# EasyEDA Pro project Exam.epro

# Schematic Schematic1

## Sheets
1 P1: Board Name: Board1; Create Date: 2025-04-11; Page Name: P1; Project Name: TUSB4020BPHP; Schematic Name: Schematic1; Update Date: 2025-04-18; Company: 嘉立创EDA; Page Size: A3; Version: V1.0
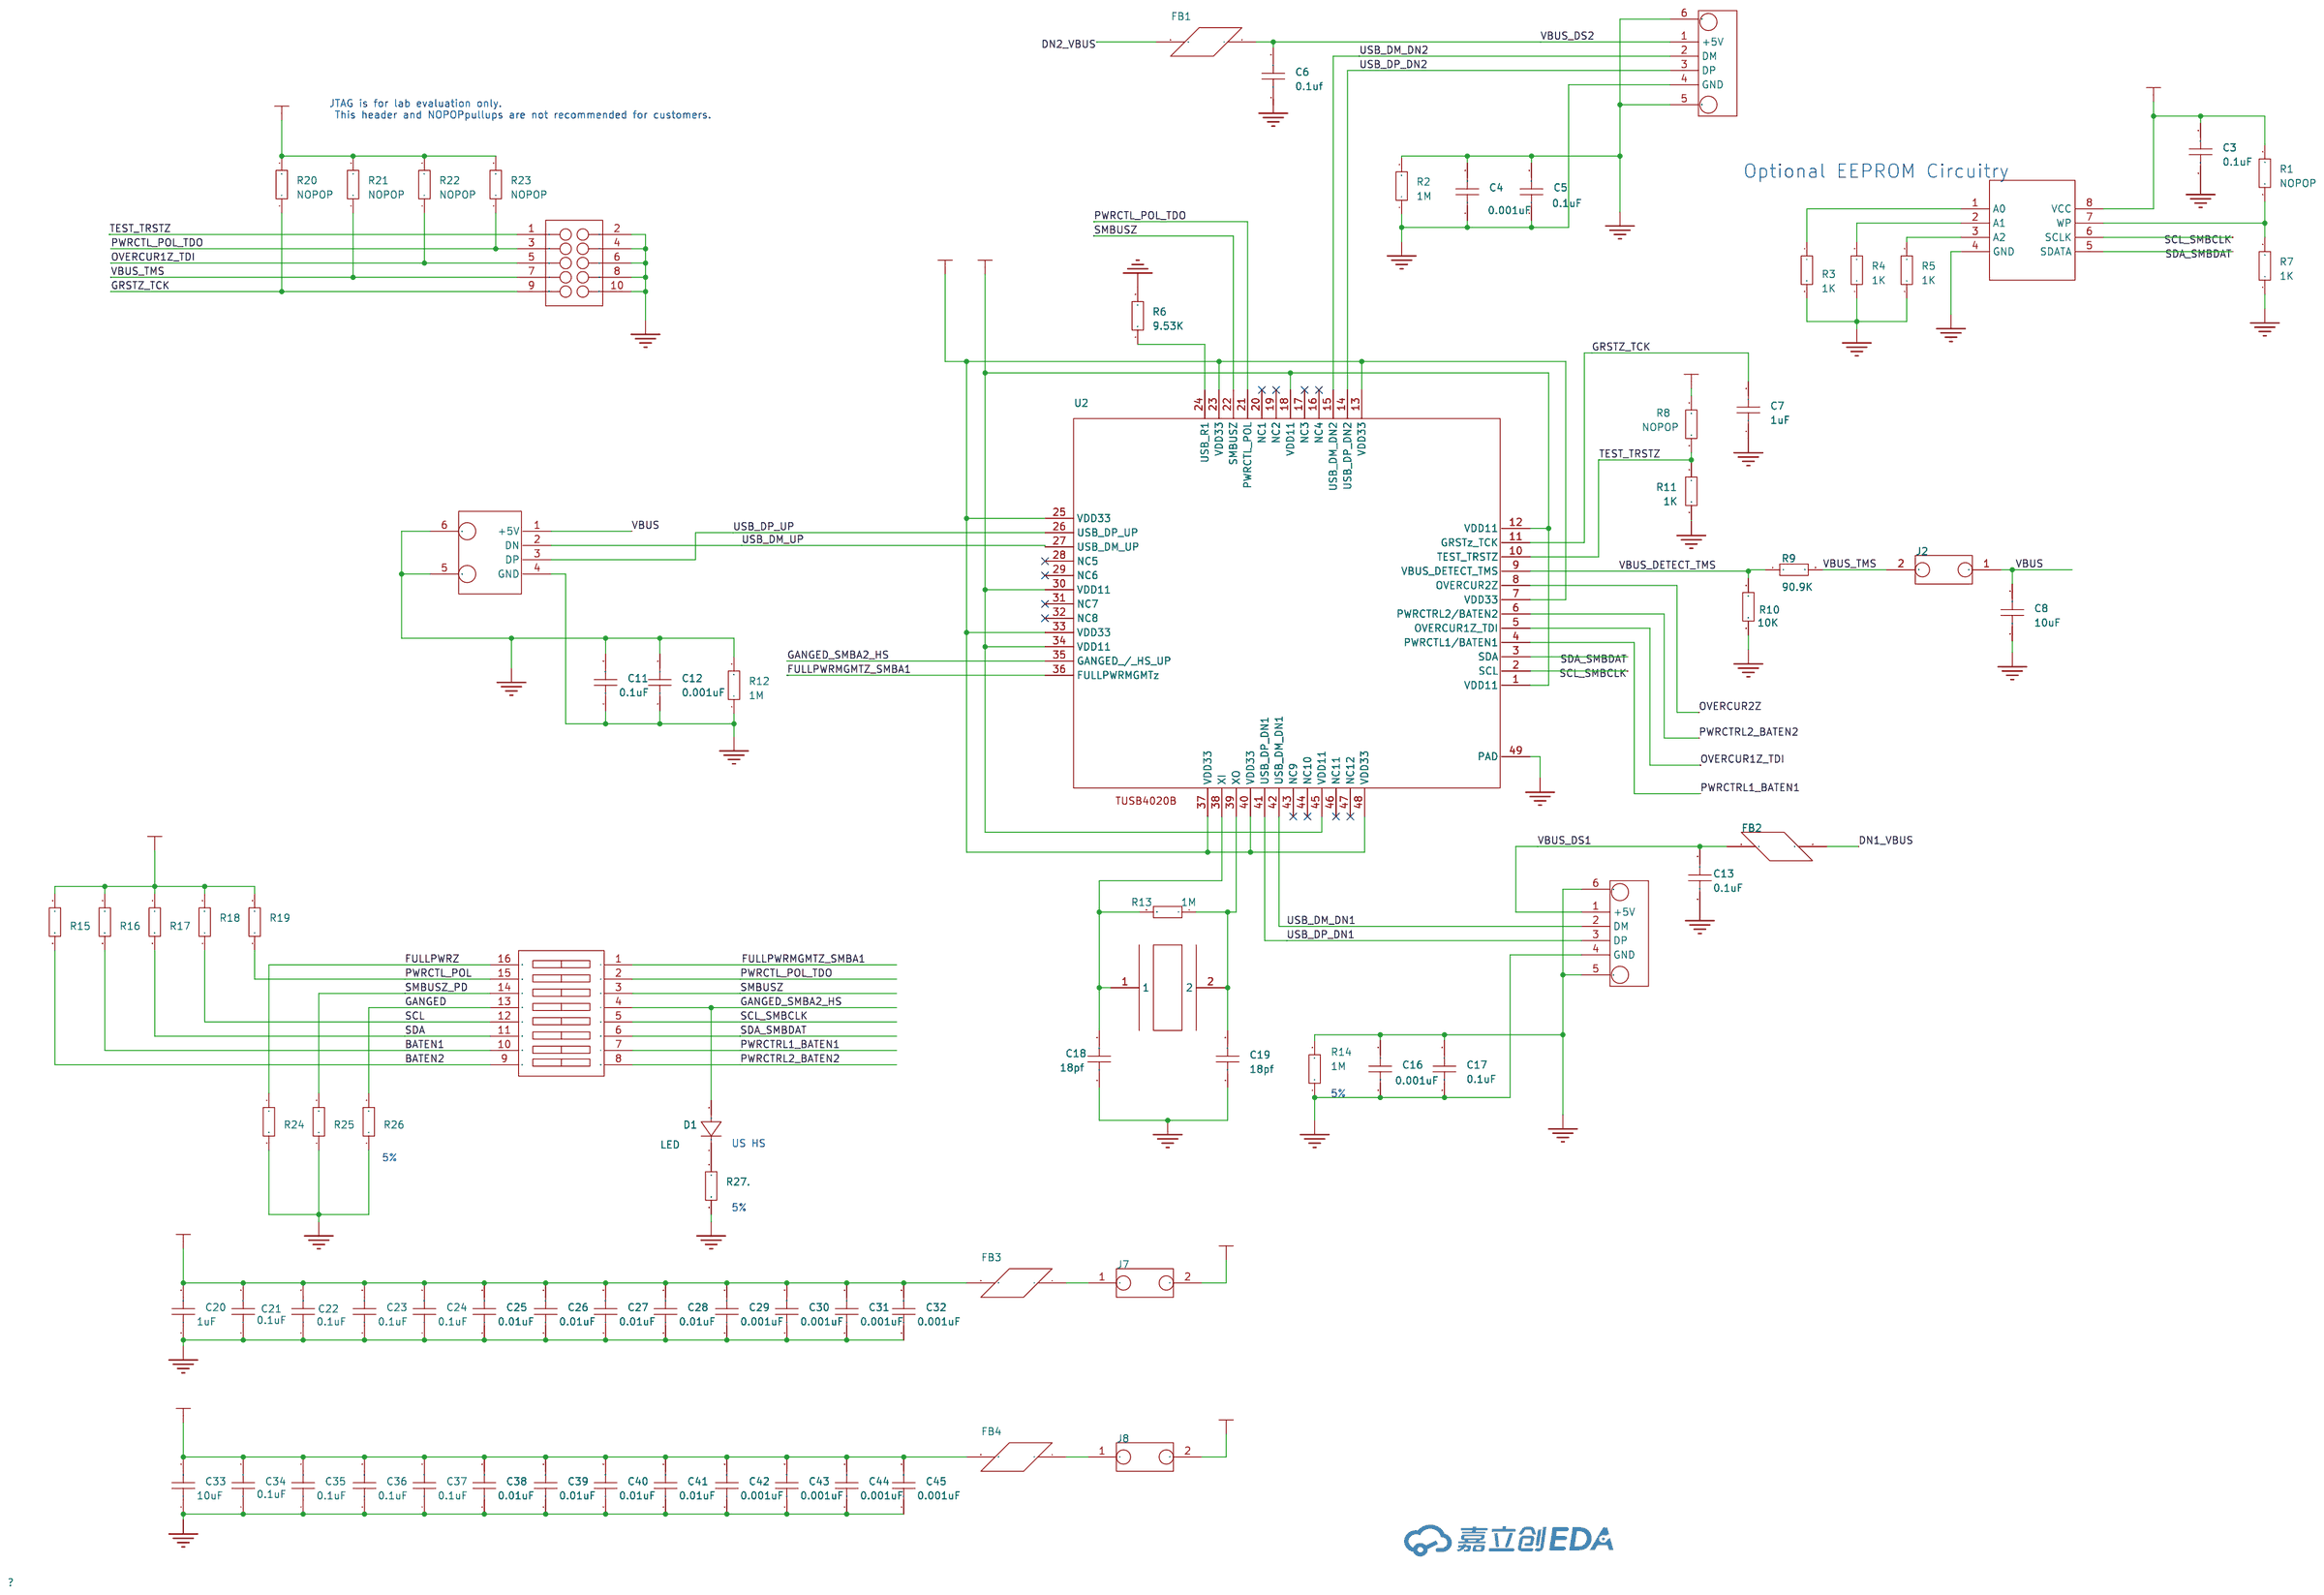
[diagram p0: P1]
2 P2: Create Date: 2025-04-13; Page Name: P2; Page Size: A4
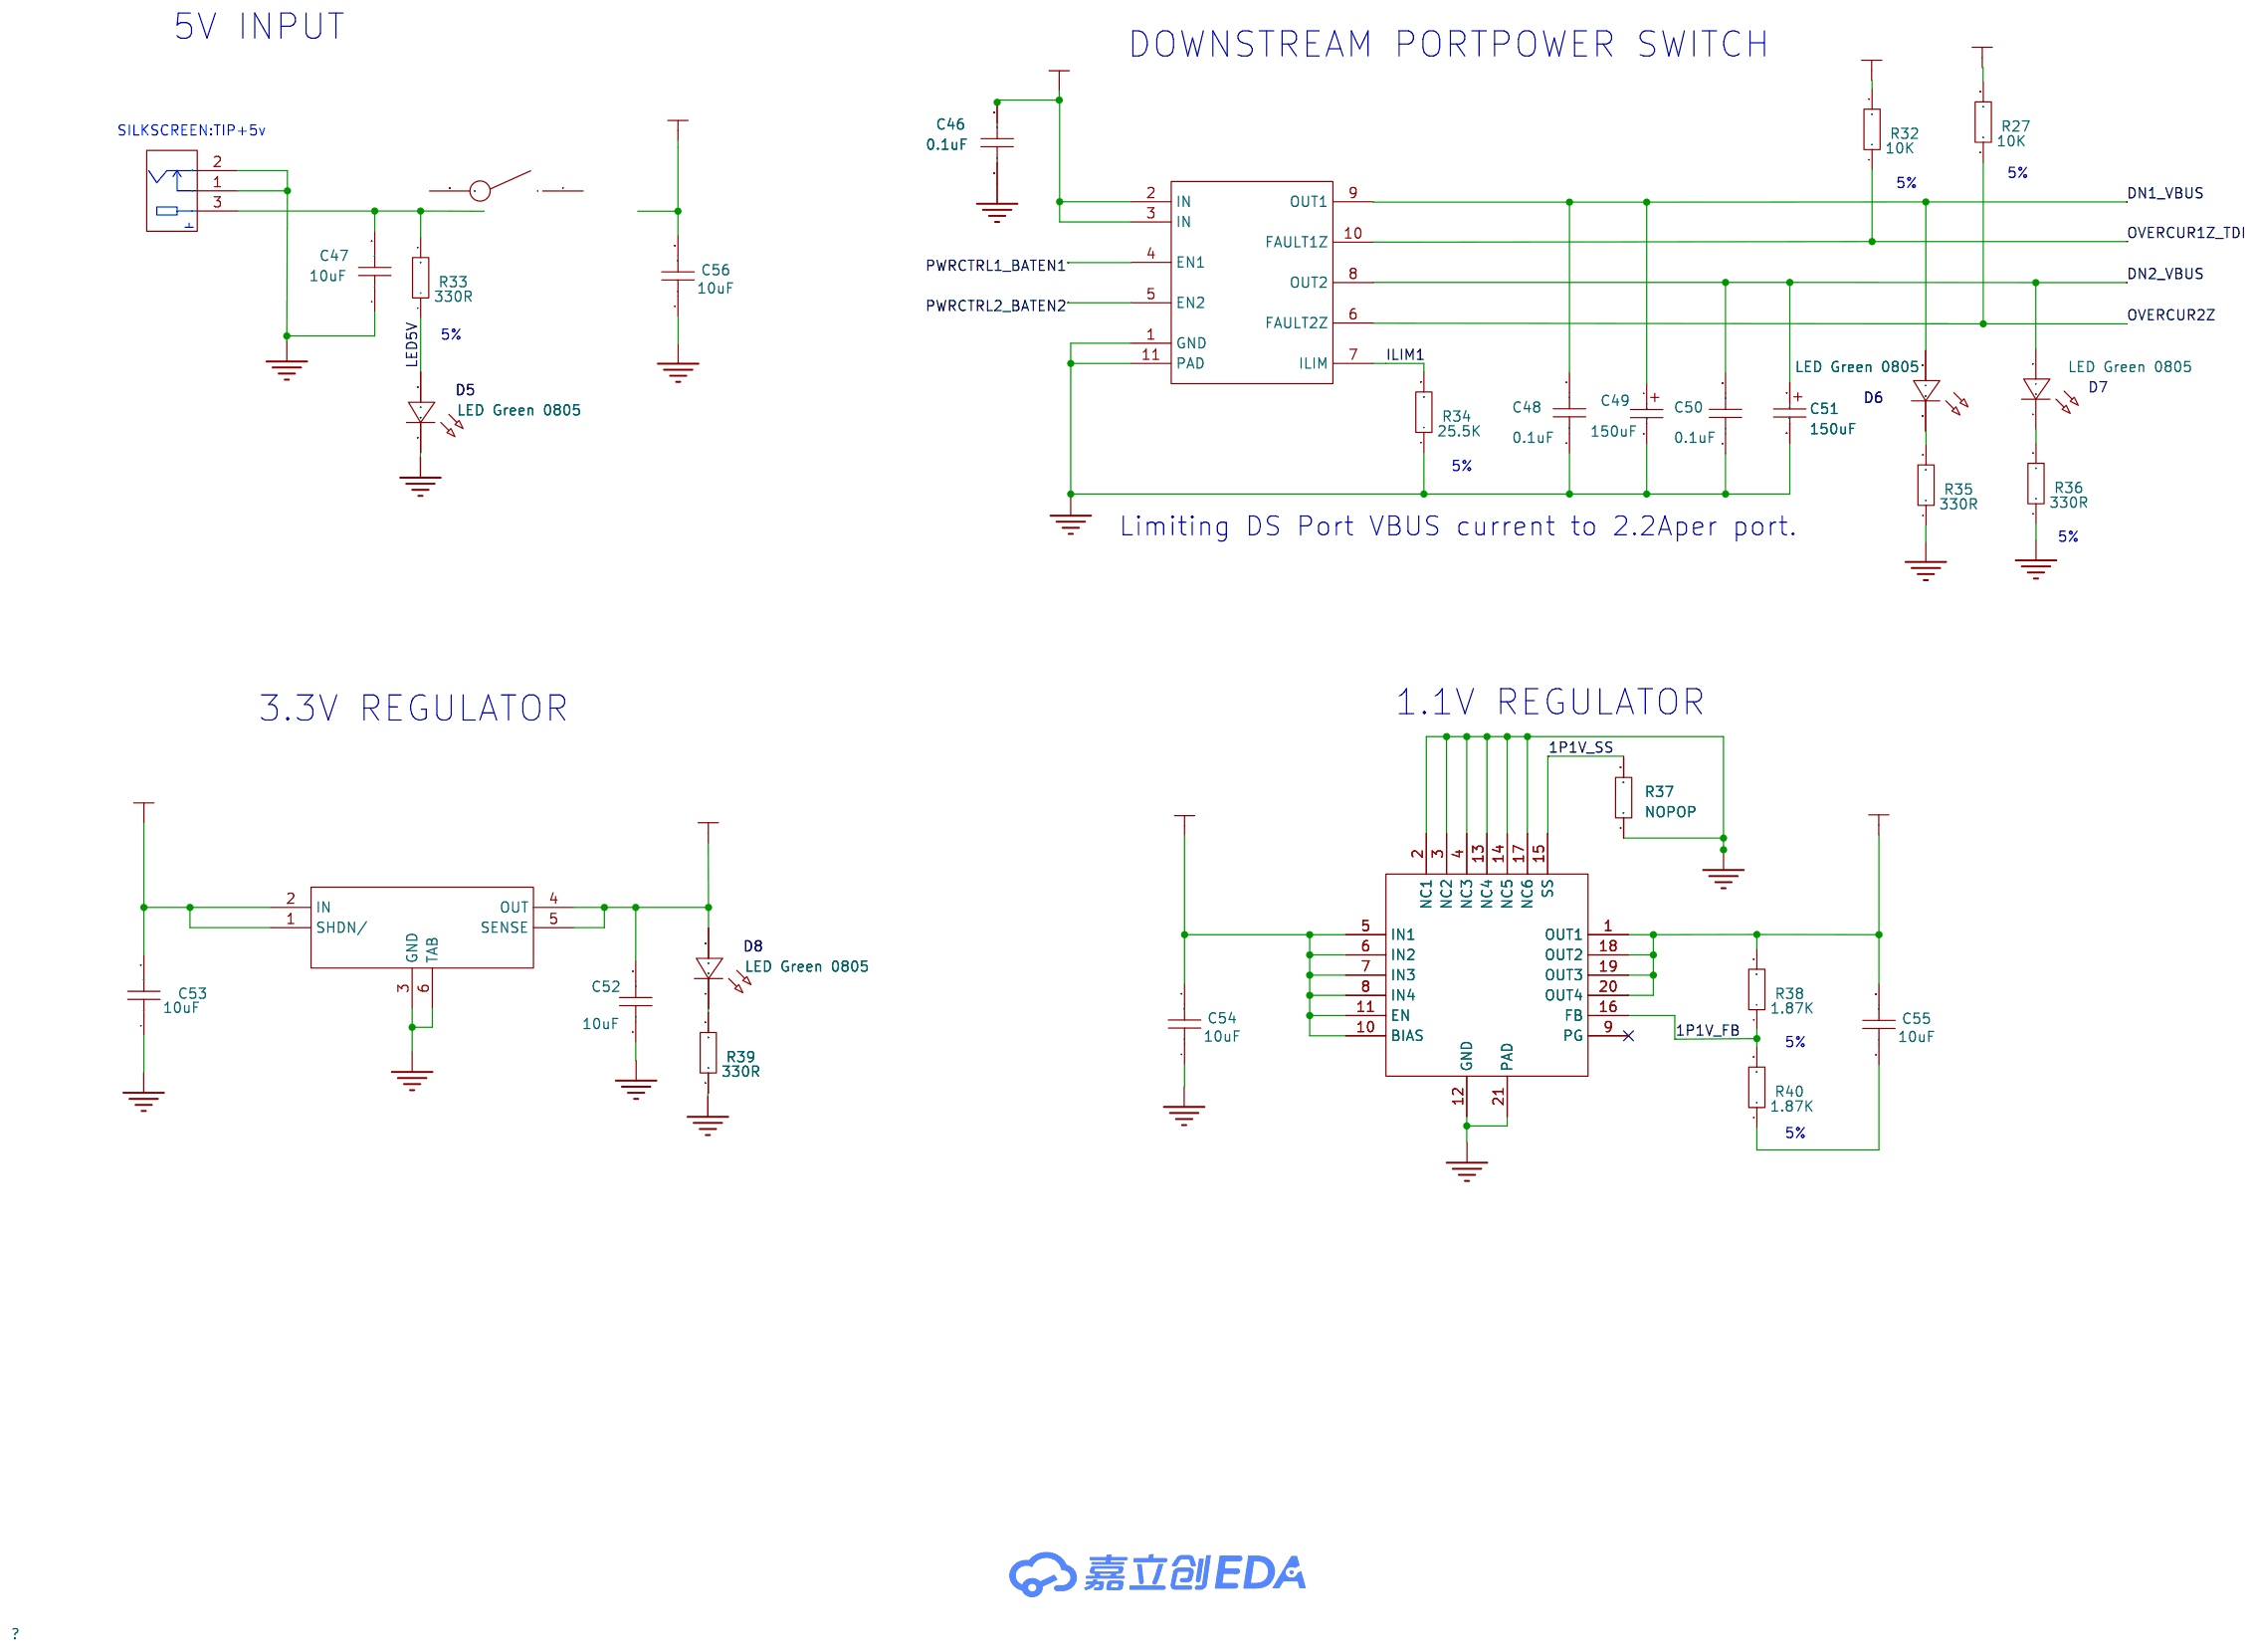
[diagram p1: P2]

## Parts
sheet P1
C3  0.1uF  [C0603]
C4  0.001uF  [C0603]
C5  0.1uF  [C0603]
C6  0.1uf  [C0603]
C7  1uF  [C0603]
C8  10uF  [C0603]
C11  0.1uF  [C0603]
C12  0.001uF  [C0603]
C13  0.1uF  [C0603]
C16  0.001uF  [C0603]
C17  0.1uF  [C0603]
C18  18pf  [C0603]
C19  18pf  [C0603]
C20  1uF  [C0603]
C21  0.1uF  [C0603]
C22  0.1uF  [C0603]
C23  0.1uF  [C0603]
C24  0.1uF  [C0603]
C25  0.01uF  [C0603]
C26  0.01uF  [C0603]
C27  0.01uF  [C0603]
C28  0.01uF  [C0603]
C29  0.001uF  [C0603]
C30  0.001uF  [C0603]
C31  0.001uF  [C0603]
C32  0.001uF  [C0603]
C33  10uF  [C0603]
C34  0.1uF  [C0603]
C35  0.1uF  [C0603]
C36  0.1uF  [C0603]
C37  0.1uF  [C0603]
C38  0.01uF  [C0603]
C39  0.01uF  [C0603]
C40  0.01uF  [C0603]
C41  0.01uF  [C0603]
C42  0.001uF  [C0603]
C43  0.001uF  [C0603]
C44  0.001uF  [C0603]
C45  0.001uF  [C0603]
D1  LED  [LED_0805]
FB1  -  [L0805]
FB2  -  [L0805]
FB3  -  [L0805]
FB4  -  [L0805]
J2  -  [HDR-TH_2P-P2.54-V-F]
J7  -  [HDR-TH_2P-P2.54-V-F]
J8  -  [HDR-TH_2P-P2.54-V-F]
JP1  -  [CONN-TH_10P-P2.00_HCTL_HC-PHD-2X5A]
R1  NOPOP  [R0603]
R2  1M  [R0603]
R3  1K  [R0603]
R4  1K  [R0603]
R5  1K  [R0603]
R6  9.53K  [R0603]
R7  1K  [R0603]
R8  NOPOP  [R0603]
R9  90.9K  [R0603]
R10  10K  [R0603]
R11  1K  [R0603]
R12  1M  [R0603]
R13  1M  [R0603]
R14  1M  [R0603]
R15  10K  [R0603]
R16  10K  [R0603]
R17  10K  [R0603]
R18  10K  [R0603]
R19  10K  [R0603]
R20  NOPOP  [R0603]
R21  NOPOP  [R0603]
R22  NOPOP  [R0603]
R23  NOPOP  [R0603]
R24  10K  [R0603]
R25  10K  [R0603]
R26  10K  [R0603]
R27.  10K  [R0603]
SW1  -  [SW-SMD_16P-L11.7-W5.4-P1.27-LS8.5_1]
U1  -  [DIP-8_L9.8-W6.6-P2.54-LS7.6-BL]
U2  -  [HTQFP-48_L7.0-W7.0-P0.50-LS9.0-BL-EP4.4]
U6  -  [USB-B-TH_HX-TYPE-BF-90]
U11  -  [Type A]
U12  -  [Type A]
Y1  -  [CRYSTAL-SMD_L5.0-W3.2]
sheet P2
C46  0.1uF  [C0603]
C47  10uF  [C0603]
C48  0.1uF  [C0603]
C49  150uF  [C_Ele_SMD_3x5.4mm]
C50  0.1uF  [C0603]
C51  150uF  [C_Ele_SMD_3x5.4mm]
C52  10uF  [C0603]
C53  10uF  [C0603]
C54  10uF  [C0603]
C55  10uF  [C0603]
C56  10uF  [C0603]
D5  LED Green 0805  [LED_0805]
D6  LED Green 0805  [LED_0805]
D7  LED Green 0805  [LED_0805]
D8  LED Green 0805  [LED_0805]
J5  -  [DC-IN-TH_EJ503A]
R27  10K  [R0603]
R32  10K  [R0603]
R33  330R  [R0603]
R34  25.5K  [R0603]
R35  330R  [R0603]
R36  330R  [R0603]
R37  NOPOP  [R0603]
R38  1.87K  [R0603]
R39  330R  [R0603]
R40  1.87K  [R0603]
SW3  -  [SW-TH_3P-P4.80_HX-SS12D10G6-WJ]
U3  -  [VSON-10_L3.0-W3.0-P0.50-TL-EP-2]
U4  -  [SOT-223-6_L6.5-W3.5-P1.27-LS7.0-BR]
U5  -  [VQFN-20_L5.0-W5.0-P0.65-TL-EP3.2]

## Library data of the parts
C3-C8 C11-C13 C16-C48 C50 C52-C56 = CAP_0603: Supplier Footprint: 0603
D1 = D_1N4007A: Supplier Footprint: DO-41
FB1-FB4 = 220 @ 100MHZ
J2 J7 J8 =  Header 1x2
JP1 = Conn 2x5 shroud
R1-R27 R27. R32-R40 = Res_0603: Supplier Footprint: 0603
SW1 = TDA08H0SK1R
U1 = AT24C04
U2 = tusb4020b: 工程主控
U6 = Type B USB-Shield
U11 U12 = Type A USB-Shield
Y1 = ECS-24MHZ
C49 C51 = C_Ele_SMD_3x5.4mm: Supplier Footprint: SMD,3x5.4mm
D5-D8 = LED_0805-G: Supplier Footprint: 0805
J5 = 2.1mm x 5.5mm
SW3 = L101011MS02Q
U3 = TPS2561
U4 = TPS7A4533
U5 = TPS74801RGW

## Nets
GND: C3.1 C4.1 C4.2 C5.1 C5.2 C6.1 C7.1 C8.1 C11.1 C11.2 C12.1 C12.2 C13.1 C16.1 C16.2 C17.1 C17.2 C18.1 C19.1 C20.1 C21.1 C22.1 C23.1 C24.1 C25.1 C26.1 C27.1 C28.1 C29.1 C30.1 C31.1 C32.1 C33.1 C34.1 C35.1 C36.1 C37.1 C38.1 C39.1 C40.1 C41.1 C42.1 C43.1 C44.1 C45.1 C46.1 C47.1 C48.1 C49.2 C50.1 C51.2 C52.1 C53.1 C54.1 J5.1(2) J5.2(3) JP1.2 JP1.4 JP1.6 JP1.8 JP1.10 R2.1 R2.2 R3.2 R4.1 R5.1 R6.2 R7.1 R10.2 R11.2 R12.1 R12.2 R14.1 R14.2 R24.2 R25.1 R26.1 R27..2 R34.1 R37.1 U1.4(GND) U2.49(PAD) U3.1(GND) U3.11(PAD) U4.6(TAB) U5.2(NC1) U5.3(NC2) U5.4(NC3) U5.12(GND) U5.13(NC4) U5.14(NC5) U5.17(NC6) U5.21(PAD) U6.4(GND) U6.5 U6.6 U11.4(GND) U11.5 U11.6 U12.4(GND) U12.5 U12.6
VBUS: C8.2 J2.1 U6.1(+5V)
VBUS_DETECT_TMS: R9.1 R10.1 U2.9(VBUS_DETECT_TMS)
VBUS_DS1: C13.2 FB2.1 U11.1(+5V)
VBUS_DS2: C6.2 FB1.1 U12.1(+5V)
VBUS_TMS: J2.2 JP1.7 R9.2 R21.1
VDD11: C33.2 C34.2 C35.2 C36.2 C37.2 C38.2 C39.2 C40.2 C41.2 C42.2 C43.2 C44.2 C45.2 FB4.2 U2.1(VDD11) U2.12(VDD11) U2.18(VDD11) U2.30(VDD11) U2.34(VDD11) U2.45(VDD11)
VDD33: C20.2 C21.2 C22.2 C23.2 C24.2 C25.2 C26.2 C27.2 C28.2 C29.2 C30.2 C31.2 C32.2 FB3.2 R8.1 U2.7(VDD33) U2.13(VDD33) U2.23(VDD33) U2.25(VDD33) U2.33(VDD33) U2.37(VDD33) U2.40(VDD33) U2.48(VDD33)
1P1V_FB: R38.1 U5.16(FB)
1P1V_SS: R37.2
BATEN1: R16.2 SW1.10
BATEN2: R15.2 SW1.9
BOARD_1P1V: C55.2 J8.2 R38.2 U5.1(OUT1) U5.18(OUT2) U5.19(OUT3) U5.20(OUT4)
BOARD_3P3V: C3.2 C52.2 C54.2 D8.2(A) J7.2 R1.2 R15.1 R16.1 R17.1 R18.2 R19.2 R20.2 R21.2 R22.2 R23.2 R32.2 U1.8(VCC) U4.4(OUT) U4.5(SENSE) U5.5(IN1) U5.6(IN2) U5.7(IN3) U5.8(IN4) U5.10(BIAS) U5.11(EN)
BOARD_5V: C46.2 C53.2 C56.2 U3.2(IN) U3.3(IN) U4.1(SHDN/) U4.2(IN)
DN1_VBUS: C48.2 C49.1 FB2.2 U3.9(OUT1)
DN2_VBUS: C50.2 C51.1 D7.2(A) FB1.2
FULLPWRMGMTZ_SMBA1: SW1.1 U2.36(FULLPWRMGMTz)
FULLPWRZ: R24.1 SW1.16
GANGED: R26.2 SW1.13
GANGED_SMBA2_HS: D1.2(A) SW1.4 U2.35(GANGED / HS_UP)
GRSTZ_TCK: C7.2 JP1.9 R20.1 U2.11(GRSTz_TCK)
ILIM1: R34.2 U3.7(ILIM)
LED5V: R33.1
OVERCUR1Z_TDI: JP1.5 R22.1 R32.1 U2.5(OVERCUR1Z_TDI) U3.10(FAULT1Z)
OVERCUR2Z: R27.1 U2.8(OVERCUR2Z)
PWRCTL_POL: R19.1 SW1.15
PWRCTL_POL_TDO: JP1.3 R23.1 SW1.2 U2.21(PWRCTL_POL)
PWRCTRL1_BATEN1: SW1.7 U2.4(PWRCTL1/BATEN1)
PWRCTRL2_BATEN2: SW1.8 U2.6(PWRCTRL2/BATEN2)
SCL: R18.1 SW1.12
SCL_SMBCLK: SW1.5 U1.6(SCLK) U2.2(SCL)
SDA: R17.2 SW1.11
SDA_SMBDAT: SW1.6 U1.5(SDATA) U2.3(SDA)
SMBUSZ: SW1.3 U2.22(SMBUSZ)
SMBUSZ_PD: R25.2 SW1.14
TEST_TRSTZ: JP1.1 R8.2 R11.1 U2.10(TEST_TRSTZ)
USB_DM_DN1: U2.42(USB_DM_DN1) U11.2(DM)
USB_DM_DN2: U2.15(USB_DM_DN2) U12.2(DM)
USB_DM_UP: U2.27(USB_DM_UP) U6.2(DN)
USB_DP_DN1: U2.41(USB_DP_DN1) U11.3(DP)
USB_DP_DN2: U2.14(USB_DP_DN2) U12.3(DP)
USB_DP_UP: U2.26(USB_DP_UP) U6.3(DP)
$1N4636: D1.1(K) R27..1
$1N5515: R3.1 U1.1(A0)
$1N5523: R4.2 U1.2(A1)
$1N5529: R5.2 U1.3(A2)
$1N5685: R1.1 R7.2 U1.7(WP)
$1N8206: R6.1 U2.24(USB_R1)
$1N9198: C18.2 R13.2 U2.38(XI) Y1.1
$1N9206: C19.2 R13.1 U2.39(XO) Y1.2
$1N11093: FB3.1 J7.1
$1N11978: FB4.1 J8.1
$2N4070: C55.1 R40.1
Net-(C47-2): C47.2 J5.3(1) R33.2

Not connected (* = marked no-connect by the designer): C56 1; D5 1(C) 2(A); D6 1(C) 2(A); D7 1(C); D8 1(C); R27 2; R35 1 2; R36 1 2; R39 1 2; R40 2; SW3 1 2; U2 16(NC4)* 17(NC3)* 19(NC2)* 20(NC1)* 28(NC5)* 29(NC6)* 31(NC7)* 32(NC8)* 43(NC9)* 44(NC10)* 46(NC11)* 47(NC12)*; U3 4(EN1) 5(EN2) 6(FAULT2Z) 8(OUT2); U4 3(GND); U5 9(PG)* 15(SS)

## Notes on the sheets
sheet 1
- JTAG is for lab evaluation only.
   This header and NOPOPpullups are not recommended for customers.
- Optional EEPROM Circuitry
- 5%
- US HS
- 5%
- 5%
sheet 2
- 5V INPUT
- DOWNSTREAM PORTPOWER SWITCH
- 5%
- 5%
- 5%
- 5%
- Limiting DS Port VBUS current to 2.2Aper port.
- 5%
- 3.3V REGULATOR
- 1.1V REGULATOR
- 5%
- 5%

# Board PCB1
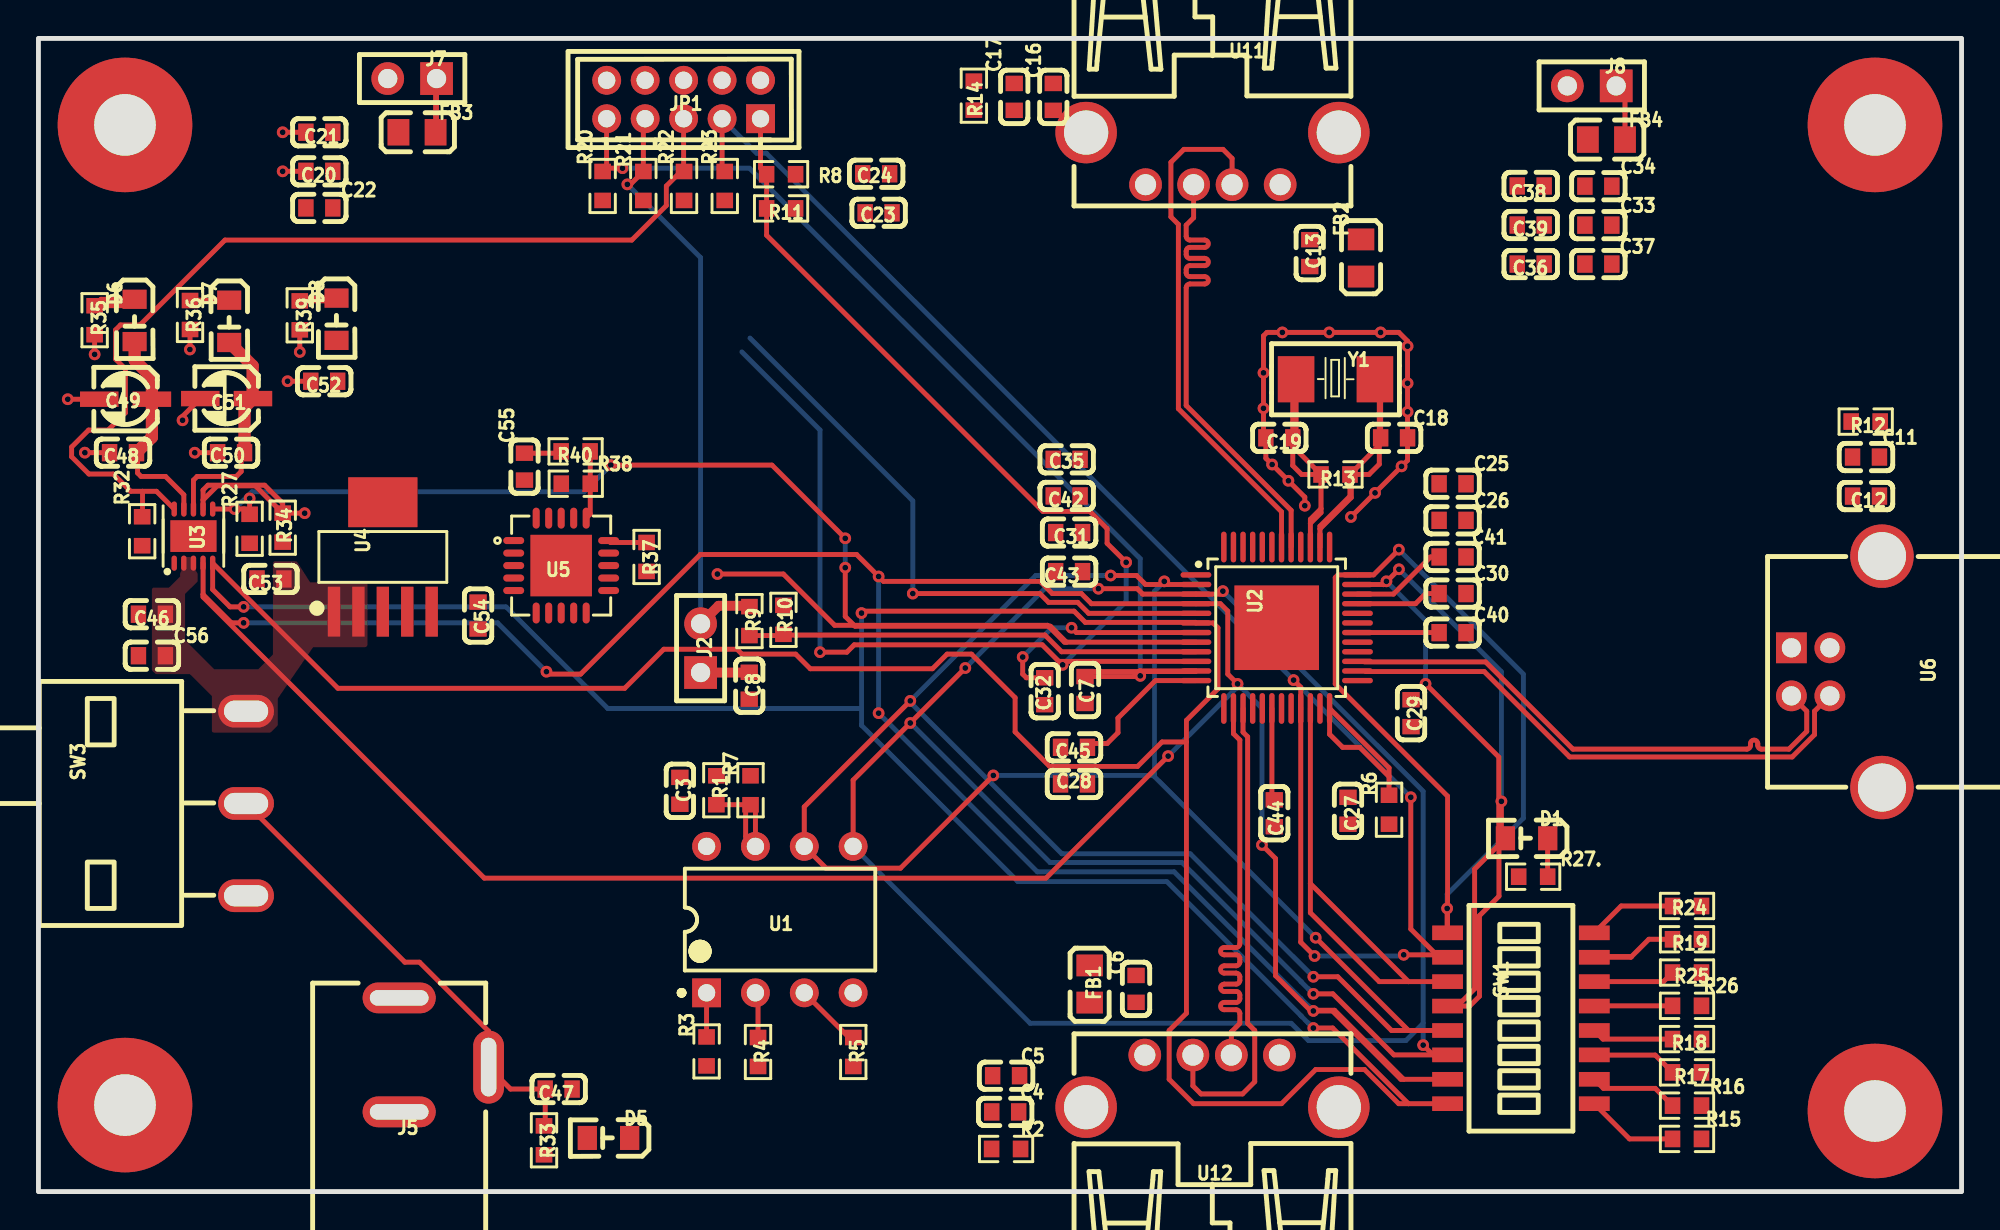
[diagram p2: board, top side]
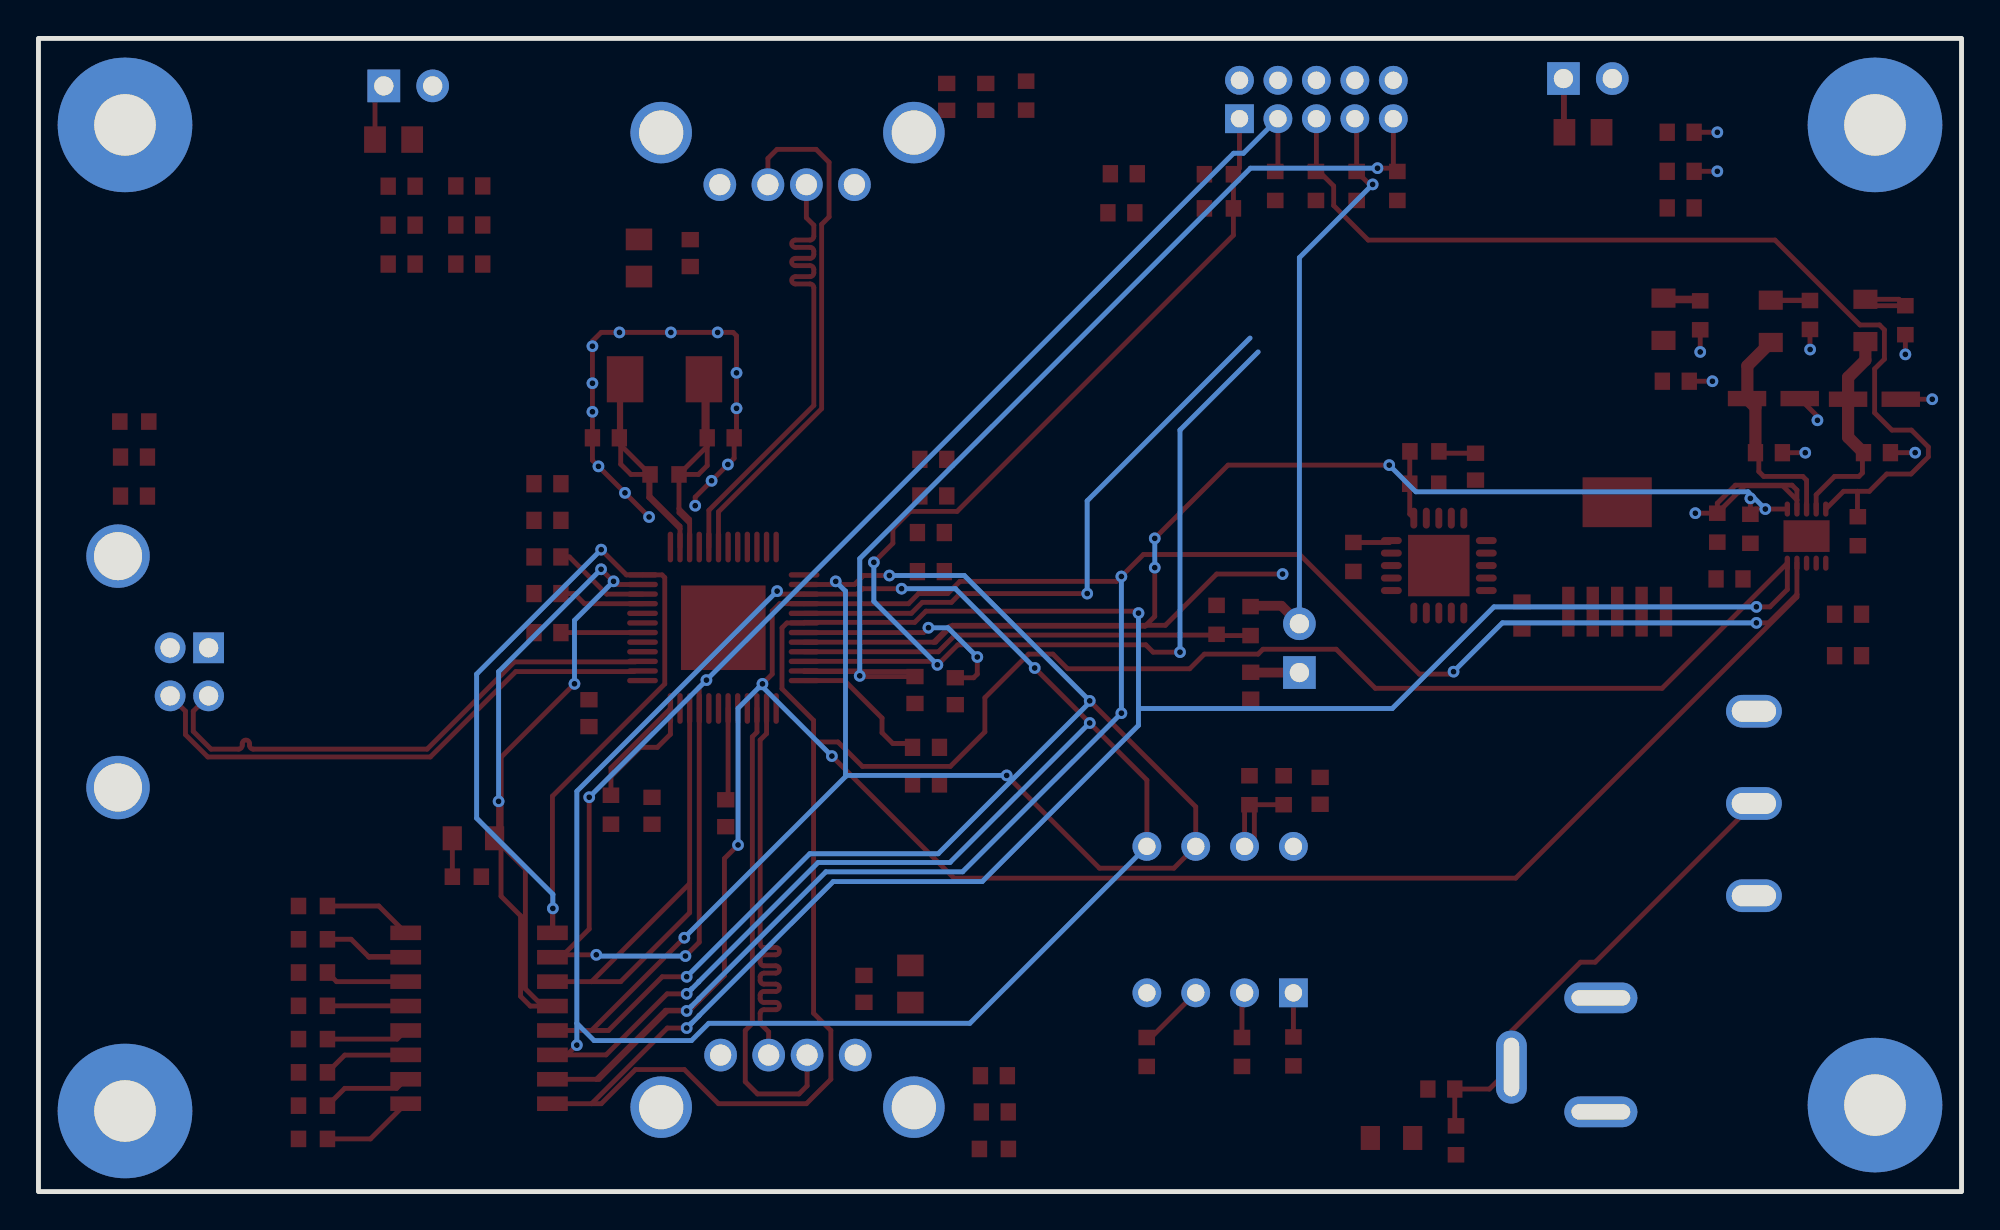
[diagram p3: board, bottom side, seen from below]

Outline 100 x 60 mm; copper layers: Top Layer, Inner1, Inner2, Bottom Layer. Coordinates in mm from the lower left corner of the outline.
Outline path: rectangle 0,60 100,0
Stack: Top Layer 0.035mm 外层铜厚1oz / Dielectric1 0.2104mm 7628 RC49% 8.6mil / Inner1 0.0152mm 内层铜厚 / Dielectric2 1.065mm 1.1mm H/HOZ Copper / Inner2 0.0152mm 内层铜厚 / Dielectric3 0.2104mm 7628 RC49% 8.6mil / Bottom Layer 0.035mm 外层铜厚1oz

## Design rules (mm)
net USB_DP_DN2: DP2
net USB_DM_DN2: DP2
net USB_DP_UP: DP3
net USB_DM_UP: DP3
net USB_DP_DN1: DP1
net USB_DM_DN1: DP1
template: 自定义配置
spacing copperThickness1oz (default): track to track 0.203, other pairs 0.203 to 0.203
spacing copperThickness2oz: track to track 0.203, other pairs 0.152 to 0.3
track width copperThickness1oz (default): min 0.127, default 0.254, max 2.54
track width copperThickness2oz: min 0.203, default 0.254, max 2.54
differential pair differentialPair (default): width min 0.203, default 0.203, max 2.54; gap min 0.152, default 0.152
via viaSize (default): diameter min 0.5, default 0.61, max 10; hole min 0.3, default 0.305, max 6.299

## Placement (name value [footprint] x y rotation side)
C3  0.1uF  [C0603]  33.35 20.85 90 top
C4  0.001uF  [C0603]  50.27 4.14 180 top
C5  0.1uF  [C0603]  50.32 6.03 180 top
C6  0.1uf  [C0603]  57.07 10.55 270 top
C7  1uF  [C0603]  54.42 26.1 90 top
C8  10uF  [C0603]  36.96 26.32 90 top
C11  0.1uF  [C0603]  95.03 38.22 180 top
C12  0.001uF  [C0603]  95.03 36.19 0 top
C13  0.1uF  [C0603]  66.11 48.83 90 top
C16  0.001uF  [C0603]  52.77 56.96 270 top
C17  0.1uF  [C0603]  50.74 56.96 270 top
C18  18pf  [C0603]  70.49 39.22 180 top
C19  18pf  [C0603]  64.52 39.22 0 top
C20  1uF  [C0603]  14.61 53.09 0 top
C21  0.1uF  [C0603]  14.61 55.12 0 top
C22  0.1uF  [C0603]  14.61 51.18 0 top
C23  0.1uF  [C0603]  43.69 50.93 180 top
C24  0.1uF  [C0603]  43.56 52.96 180 top
C25  0.01uF  [C0603]  73.53 36.83 180 top
C26  0.01uF  [C0603]  73.53 34.92 180 top
C27  0.01uF  [C0603]  68.1 19.81 90 top
C28  0.01uF  [C0603]  53.85 21.21 0 top
C29  0.001uF  [C0603]  71.37 24.89 90 top
C30  0.001uF  [C0603]  73.53 31.11 180 top
C31  0.001uF  [C0603]  53.59 34.29 0 top
C32  0.001uF  [C0603]  52.32 26.03 90 top
C33  10uF  [C0603]  81.11 50.29 180 top
C34  0.1uF  [C0603]  81.11 52.31 180 top
C35  0.1uF  [C0603]  53.47 38.1 0 top
C36  0.1uF  [C0603]  77.6 48.26 0 top
C37  0.1uF  [C0603]  81.11 48.26 180 top
C38  0.01uF  [C0603]  77.6 52.32 0 top
C39  0.01uF  [C0603]  77.6 50.29 0 top
C40  0.01uF  [C0603]  73.53 29.08 180 top
C41  0.01uF  [C0603]  73.53 33.02 180 top
C42  0.001uF  [C0603]  53.47 36.19 0 top
C43  0.001uF  [C0603]  53.59 32.26 0 top
C44  0.001uF  [C0603]  64.26 19.69 90 top
C45  0.001uF  [C0603]  53.85 23.11 0 top
C46  0.1uF  [C0603]  5.9 30.04 0 top
C47  10uF  [C0603]  27.05 5.33 180 top
C48  0.1uF  [C0603]  4.4 38.45 0 top
C49  150uF  [C_Ele_SMD_3x5.4mm]  4.53 41.24 0 top
C50  0.1uF  [C0603]  10.02 38.44 0 top
C51  150uF  [C_Ele_SMD_3x5.4mm]  9.78 41.28 0 top
C52  10uF  [C0603]  14.86 42.16 0 top
C53  10uF  [C0603]  12.06 31.88 0 top
C54  10uF  [C0603]  22.86 29.97 90 top
C55  10uF  [C0603]  25.27 37.72 270 top
C56  10uF  [C0603]  5.9 27.88 0 top
D1  LED  [LED_0805]  77.33 18.39 180 top
D5  LED Green 0805  [LED_0805]  29.59 2.79 180 top
D6  LED Green 0805  [LED_0805]  5 45.28 270 top
D7  LED Green 0805  [LED_0805]  9.91 45.23 270 top
D8  LED Green 0805  [LED_0805]  15.49 45.34 270 top
FB1  -  [L0805]  54.66 10.8 90 top
FB2  -  [L0805]  68.77 48.58 270 top
FB3  -  [L0805]  19.69 55.12 180 top
FB4  -  [L0805]  81.53 54.74 180 top
J2  -  [HDR-TH_2P-P2.54-V-F]  34.43 28.28 90 top
J5  -  [DC-IN-TH_EJ503A]  21.08 7.11 0 top
J7  -  [HDR-TH_2P-P2.54-V-F]  19.43 57.91 180 top
J8  -  [HDR-TH_2P-P2.54-V-F]  80.77 57.53 180 top
JP1  -  [CONN-TH_10P-P2.00_HCTL_HC-PHD-2X5A]  33.55 56.82 0 top
NOREF  -  [Pad_e124]  95.5 4.19 0 top
NOREF#2  -  [Pad_e122]  4.5 55.5 0 top
NOREF#3  -  [Pad_e120]  4.5 4.5 0 top
NOREF#4  -  [Pad_e123]  95.5 55.5 0 top
R1  NOPOP  [R0603]  35.25 20.88 90 top
R2  1M  [R0603]  50.32 2.22 180 top
R3  1K  [R0603]  34.74 7.29 270 top
R4  1K  [R0603]  37.42 7.26 90 top
R5  1K  [R0603]  42.37 7.26 90 top
R6  9.53K  [R0603]  70.23 19.87 270 top
R7  1K  [R0603]  37.03 20.88 270 top
R8  NOPOP  [R0603]  38.62 52.93 180 top
R9  90.9K  [R0603]  36.97 29.68 90 top
R10  10K  [R0603]  38.74 29.75 90 top
R11  1K  [R0603]  38.62 51.16 0 top
R12  1M  [R0603]  95.02 40.06 0 top
R13  1M  [R0603]  67.45 37.31 0 top
R14  1M  [R0603]  48.64 57.02 270 top
R15  10K  [R0603]  85.72 2.74 180 top
R16  10K  [R0603]  85.72 4.47 180 top
R17  10K  [R0603]  85.72 6.2 180 top
R18  10K  [R0603]  85.72 7.93 0 top
R19  10K  [R0603]  85.72 13.13 0 top
R20  NOPOP  [R0603]  29.34 52.32 270 top
R21  NOPOP  [R0603]  31.45 52.32 270 top
R22  NOPOP  [R0603]  33.57 52.32 270 top
R23  NOPOP  [R0603]  35.69 52.32 270 top
R24  10K  [R0603]  85.72 14.86 0 top
R25  10K  [R0603]  85.72 11.4 180 top
R26  10K  [R0603]  85.72 9.66 180 top
R27  10K  [R0603]  10.98 34.49 270 top
R27.  10K  [R0603]  77.72 16.38 180 top
R32  10K  [R0603]  5.39 34.36 270 top
R33  330R  [R0603]  26.29 2.67 90 top
R34  25.5K  [R0603]  12.7 34.54 90 top
R35  330R  [R0603]  2.92 45.34 90 top
R36  330R  [R0603]  7.88 45.61 90 top
R37  NOPOP  [R0603]  31.62 33.02 90 top
R38  1.87K  [R0603]  27.94 36.83 180 top
R39  330R  [R0603]  13.59 45.59 90 top
R40  1.87K  [R0603]  27.93 38.51 0 top
SW1  -  [SW-SMD_16P-L11.7-W5.4-P1.27-LS8.5_1]  77.09 9.02 270 top
SW3  -  [SW-TH_3P-P4.80_HX-SS12D10G6-WJ]  10.8 20.19 270 top
U1  -  [DIP-8_L9.8-W6.6-P2.54-LS7.6-BL]  38.55 14.15 0 top
U2  -  [HTQFP-48_L7.0-W7.0-P0.50-LS9.0-BL-EP4.4]  64.39 29.34 270 top
U3  -  [VSON-10_L3.0-W3.0-P0.50-TL-EP-2]  8.06 34.11 90 top
U4  -  [SOT-223-6_L6.5-W3.5-P1.27-LS7.0-BR]  17.91 33.02 270 top
U5  -  [VQFN-20_L5.0-W5.0-P0.65-TL-EP3.2]  27.18 32.57 0 top
U6  -  [USB-B-TH_HX-TYPE-BF-90]  93.51 27.04 90 top
U11  -  [Type A]  61.05 53.75 180 top
U12  -  [Type A]  61.05 5.75 0 top
Y1  -  [CRYSTAL-SMD_L5.0-W3.2]  67.45 42.27 180 top

## Footprints (pads in the part's own frame, mm; a bottom-side part is the same pattern mirrored in y, then rotated)
C0603
  rect 0.8x0.9 smd: 1(-0.7,0) 2(0.7,0)
C_Ele_SMD_3x5.4mm
  rect 1.999x0.8 smd: 1(1.374,-0.014) 2(-1.364,-0.014)
CONN-TH_10P-P2.00_HCTL_HC-PHD-2X5A
  rect 1.5x1.5 hole 0.9: 1(4,-1)
  round 1.5 hole 0.9: 2(4,1) 3(2,-1) 4(2,1) 5(0,-1) 6(0,1) 7(-2,-1) 8(-2,1) 9(-4,-1) 10(-4,1)
CRYSTAL-SMD_L5.0-W3.2
  rect 1.9x2.4 smd: 1(-2.05,0) 2(2.05,0)
DC-IN-TH_EJ503A
  oval 3.8x1.6 hole 3.05x0.8: 1(-2.325,2.965) 2(-2.325,-2.965)
  oval 1.6x3.8 hole 0.8x3.05: 3(2.325,-0.635)
DIP-8_L9.8-W6.6-P2.54-LS7.6-BL
  rect 1.5x1.5 hole 0.9: 1(-3.81,-3.81)
  round 1.5 hole 0.9: 2(-1.27,-3.81) 3(1.27,-3.81) 4(3.81,-3.81) 5(3.81,3.81) 6(1.27,3.81) 7(-1.27,3.81) 8(-3.81,3.81)
HDR-TH_2P-P2.54-V-F
  rect 1.7x1.7 hole 1: 1(-1.27,0)
  round 1.7 hole 1: 2(1.27,0)
HTQFP-48_L7.0-W7.0-P0.50-LS9.0-BL-EP4.4
  oval 0.28x1.6 smd: 1(-2.75,-4.2) 2(-2.25,-4.2) 3(-1.75,-4.2) 4(-1.25,-4.2) 5(-0.75,-4.2) 6(-0.25,-4.2) 7(0.25,-4.2) 8(0.75,-4.2) 9(1.25,-4.2) 10(1.75,-4.2) 11(2.25,-4.2) 12(2.75,-4.2) 25(2.75,4.2) 26(2.25,4.2) 27(1.75,4.2) 28(1.25,4.2) 29(0.75,4.2) 30(0.25,4.2) 31(-0.25,4.2) 32(-0.75,4.2) 33(-1.25,4.2) 34(-1.75,4.2) 35(-2.25,4.2) 36(-2.75,4.2)
  oval 1.6x0.28 smd: 13(4.2,-2.75) 14(4.2,-2.25) 15(4.2,-1.75) 16(4.2,-1.25) 17(4.2,-0.75) 18(4.2,-0.25) 19(4.2,0.25) 20(4.2,0.75) 21(4.2,1.25) 22(4.2,1.75) 23(4.2,2.25) 24(4.2,2.75) 37(-4.2,2.75) 38(-4.2,2.25) 39(-4.2,1.75) 40(-4.2,1.25) 41(-4.2,0.75) 42(-4.2,0.25) 43(-4.2,-0.25) 44(-4.2,-0.75) 45(-4.2,-1.25) 46(-4.2,-1.75) 47(-4.2,-2.25) 48(-4.2,-2.75)
  rect 4.4x4.4 smd: 49(0,0)
L0805
  rect 1.133x1.377 smd: 1(-0.966,0) 2(0.966,0)
LED_0805
  rect 1x1.25 smd: 1(-1.15,0.005) 2(1.05,0.005)
Pad_e120
  round 7 hole 3.2: (0,0)
Pad_e122
  round 7 hole 3.2: (0,0)
Pad_e123
  round 7 hole 3.2: (0,0)
Pad_e124
  round 7 hole 3.2: (0,0)
R0603
  rect 0.806x0.864 smd: 1(-0.753,0) 2(0.753,0)
SOT-223-6_L6.5-W3.5-P1.27-LS7.0-BR
  rect 2.595x0.644 smd: 1(2.848,-2.54) 2(2.848,-1.27) 3(2.848,0) 4(2.848,1.27) 5(2.848,2.54)
  rect 2.595x3.6 smd: 6(-2.848,0)
SW-SMD_16P-L11.7-W5.4-P1.27-LS8.5_1
  rect 0.76x1.6 smd: 1(-4.445,-3.815) 2(-3.175,-3.815) 3(-1.905,-3.815) 4(-0.635,-3.815) 5(0.635,-3.815) 6(1.905,-3.815) 7(3.175,-3.815) 8(4.445,-3.815) 9(4.445,3.815) 10(3.175,3.815) 11(1.905,3.815) 12(0.635,3.815) 13(-0.635,3.815) 14(-1.905,3.815) 15(-3.175,3.815) 16(-4.445,3.815)
SW-TH_3P-P4.80_HX-SS12D10G6-WJ
  oval 1.7x2.9 hole 1.1x2.3: 1(-4.8,0) 2(0,0) 3(4.8,0)
Type A
  round 1.7 hole 1.1: 1(-3.521,1.355) 2(-1.018,1.355) 3(0.981,1.355) 4(3.48,1.355)
  round 3.2 hole 2.3: 5(-6.57,-1.355) 6(6.57,-1.355)
USB-B-TH_HX-TYPE-BF-90
  rect 1.6x1.6 hole 1: 1(1.25,2.355)
  round 1.6 hole 1: 2(-1.25,2.355) 3(-1.25,0.355) 4(1.25,0.355)
  round 3.3 hole 2.5: 5(-6.02,-2.355) 6(6.02,-2.355)
VQFN-20_L5.0-W5.0-P0.65-TL-EP3.2
  oval 1.087x0.364 smd: 1(-2.469,1.3) 2(-2.469,0.65) 3(-2.469,0) 4(-2.469,-0.65) 5(-2.469,-1.3) 11(2.469,-1.3) 12(2.469,-0.65) 13(2.469,0) 14(2.469,0.65) 15(2.469,1.3)
  oval 0.364x1.087 smd: 6(-1.3,-2.469) 7(-0.65,-2.469) 8(0,-2.469) 9(0.65,-2.469) 10(1.3,-2.469) 16(1.3,2.469) 17(0.65,2.469) 18(0,2.469) 19(-0.65,2.469) 20(-1.3,2.469)
  rect 3.2x3.2 smd: 21(0,0)
VSON-10_L3.0-W3.0-P0.50-TL-EP-2
  oval 0.787x0.28 smd: 1(-1.407,1) 2(-1.407,0.499) 3(-1.407,0) 4(-1.407,-0.5) 5(-1.407,-1) 6(1.407,-1) 7(1.407,-0.5) 8(1.407,0) 9(1.407,0.499) 10(1.407,1)
  rect 1.65x2.4 smd: 11(0,0)

## Nets
GND: C3.1 C4.1 C4.2 C5.1 C5.2 C6.1 C7.1 C8.1 C11.1 C11.2 C12.1 C12.2 C13.1 C16.1 C16.2 C17.1 C17.2 C18.1 C19.1 C20.1 C21.1 C22.1 C23.1 C24.1 C25.1 C26.1 C27.1 C28.1 C29.1 C30.1 C31.1 C32.1 C33.1 C34.1 C35.1 C36.1 C37.1 C38.1 C39.1 C40.1 C41.1 C42.1 C43.1 C44.1 C45.1 C46.1 C47.1 C48.1 C49.2 C50.1 C51.2 C52.1 C53.1 C54.1 C56.1 D5.1 J5.1 J5.2 JP1.2 JP1.4 JP1.6 JP1.8 JP1.10 R2.1 R2.2 R3.2 R4.1 R5.1 R6.2 R7.1 R10.2 R11.2 R12.1 R12.2 R14.1 R14.2 R24.2 R25.1 R26.1 R27..2 R34.1 R35.1 R36.1 R37.1 R39.1 U1.4 U2.49 U3.1 U3.11 U4.3 U4.6 U5.2 U5.3 U5.4 U5.12 U5.13 U5.14 U5.17 U5.21 U6.4 U6.5 U6.6 U11.4 U11.5 U11.6 U12.4 U12.5 U12.6
VBUS: C8.2 J2.1 U6.1
VBUS_DETECT_TMS: R9.1 R10.1 U2.9
VBUS_DS1: C13.2 FB2.1 U11.1
VBUS_DS2: C6.2 FB1.1 U12.1
VBUS_TMS: J2.2 JP1.7 R9.2 R21.1
VDD11: C33.2 C34.2 C35.2 C36.2 C37.2 C38.2 C39.2 C40.2 C41.2 C42.2 C43.2 C44.2 C45.2 FB4.2 U2.1 U2.12 U2.18 U2.30 U2.34 U2.45
VDD33: C20.2 C21.2 C22.2 C23.2 C24.2 C25.2 C26.2 C27.2 C28.2 C29.2 C30.2 C31.2 C32.2 FB3.2 R8.1 U2.7 U2.13 U2.23 U2.25 U2.33 U2.37 U2.40 U2.48
1P1V_FB: R38.1 R40.2 U5.16
1P1V_SS: R37.2 U5.15
BATEN1: R16.2 SW1.10
BATEN2: R15.2 SW1.9
BOARD_1P1V: C55.2 J8.2 R38.2 U5.1 U5.18 U5.19 U5.20
BOARD_3P3V: C3.2 C52.2 C54.2 D8.2 J7.2 R1.2 R15.1 R16.1 R17.1 R18.2 R19.2 R20.2 R21.2 R22.2 R23.2 R27.2 R32.2 U1.8 U4.4 U4.5 U5.5 U5.6 U5.7 U5.8 U5.10 U5.11
BOARD_5V: C46.2 C53.2 C56.2 SW3.1 U3.2 U3.3 U4.1 U4.2
DN1_VBUS: C48.2 C49.1 D6.2 FB2.2 U3.9
DN2_VBUS: C50.2 C51.1 D7.2 FB1.2 U3.8
FULLPWRMGMTZ_SMBA1: SW1.1 U2.36
FULLPWRZ: R24.1 SW1.16
GANGED: R26.2 SW1.13
GANGED_SMBA2_HS: D1.2 SW1.4 U2.35
GRSTZ_TCK: C7.2 JP1.9 R20.1 U2.11
ILIM1: R34.2 U3.7
LED5V: D5.2 R33.1
OVERCUR1Z_TDI: JP1.5 R22.1 R32.1 U2.5 U3.10
OVERCUR2Z: R27.1 U2.8 U3.6
PWRCTL_POL: R19.1 SW1.15
PWRCTL_POL_TDO: JP1.3 R23.1 SW1.2 U2.21
PWRCTRL1_BATEN1: SW1.7 U2.4 U3.4
PWRCTRL2_BATEN2: SW1.8 U2.6 U3.5
SCL: R18.1 SW1.12
SCL_SMBCLK: SW1.5 U1.6 U2.2
SDA: R17.2 SW1.11
SDA_SMBDAT: SW1.6 U1.5 U2.3
SMBUSZ: SW1.3 U2.22
SMBUSZ_PD: R25.2 SW1.14
TEST_TRSTZ: JP1.1 R8.2 R11.1 U2.10
USB_DM_DN1: U2.42 U11.2
USB_DM_DN2: U2.15 U12.2
USB_DM_UP: U2.27 U6.2
USB_DP_DN1: U2.41 U11.3
USB_DP_DN2: U2.14 U12.3
USB_DP_UP: U2.26 U6.3
$1N4636: D1.1 R27..1
$1N5515: R3.1 U1.1
$1N5523: R4.2 U1.2
$1N5529: R5.2 U1.3
$1N5685: R1.1 R7.2 U1.7
$1N8206: R6.1 U2.24
$1N9198: C18.2 R13.2 U2.38 Y1.1
$1N9206: C19.2 R13.1 U2.39 Y1.2
$1N11093: FB3.1 J7.1
$1N11978: FB4.1 J8.1
$2N1264: C47.2 J5.3 R33.2 SW3.2
$2N2113: D6.1 R35.2
$2N2181: D7.1 R36.2
$2N3339: D8.1 R39.2
$2N4070: C55.1 R40.1

Pads without a net: SW3 3; U2 16 17 19 20 28 29 31 32 43 44 46 47; U5 9

## Via types
v1: diameter 0.61, hole 0.305, Top Layer to Bottom Layer, 73 vias

## Routing (per net, layer and track width the routed paths; a pad name or vN(x,y) marks a point on that pad's centre or on a via; arc(x,y) is an arc through that point)
GND: length 40.2
  Top Layer w0.254: R35.1 v1(2.92,43.56) ; C48.1 v1(2.41,38.45) ; v1(68.25,35.1) v1(69.5,36.36) v1(70.88,37.73) 71.19,38.05 C18.1 v1(71.19,40.57) v1(71.19,42.06) 71.19,44.25 70.74,44.7 v1(69.79,44.7) v1(67.12,44.7) v1(64.68,44.7) 63.88,44.7 63.7,44.52 v1(63.7,42.6) v1(63.7,40.75) 63.7,39.34 C19.1 63.82,38.16 v1(64.15,37.83) v1(65,36.98) 65.85,36.13 v1(65.85,35.69) ; C49.2 v1(1.52,41.23) ; C21.1 v1(12.7,55.12) ; 8.42,41.26 7.49,40.34 v1(7.49,40.13) ; 14.16,42.16 v1(12.95,42.16) ; C50.1 v1(8.13,38.44) ; R36.1 7.88,43.94 ; R39.1 v1(13.59,43.69) ; C20.1 v1(12.7,53.09)
  vias: v1(7.87,43.81) v1(71.19,43.99)
VBUS: length 2.5
  Top Layer w0.508: C8.2 36.95,27.01 J2.1
VBUS_DETECT_TMS: length 23.6
  Top Layer w0.254: R9.1 38.67,28.93 R10.1 38.78,28.96 52.34,28.96 53.2,28.09 60.19,28.09
VBUS_TMS: length 31.3
  Top Layer w0.254: JP1.7 31.45,55.73 R21.1 30.78,52.41 v1(30.62,52.41)
  Top Layer w0.508: R9.2 36.93,30.48 35.37,30.48 J2.2
  Bottom Layer w0.254: J2.2 34.43,48.6 v1(30.62,52.41)
VDD11: length 21.7
  Top Layer w0.254: U2.34 70.46,31.09 72.39,33.02 C41.2 ; C45.2 54.75,23.32 55.57,23.32 56.13,23.88 56.13,24.64 58.08,26.59 60.19,26.59 ; U2.30 72.83,29.09 C40.2 ; 64.39,20.39 64.14,20.64 U2.18
VDD33: length 16.3
  Top Layer w0.254: C30.2 72.14,31.11 71.61,30.59 U2.33 ; v1(51.18,27.81) 51.18,26.92 51.37,26.73 C32.2 ; 60.19,29.09 53.97,29.09 v1(53.72,29.34)
  Bottom Layer w0.254: v1(53.72,29.34) 52.71,29.34 v1(51.18,27.81)
1P1V_FB: length 3.6
  Top Layer w0.254: R40.2 28.69,38.5 R38.1 28.69,35.25 28.48,35.04
1P1V_SS: length 2
  Top Layer w0.254: R37.2 29.75,33.77 U5.15
BATEN1: length 4.6
  Top Layer w0.254: R16.2 84.07,5.37 81.38,5.37 SW1.10
BATEN2: length 4.8
  Top Layer w0.254: R15.2 82.74,2.74 SW1.9
DN1_VBUS: length 11.2
  Top Layer w0.254: C48.2 5.15,38.39 5.15,37.39 5.33,37.21 6.6,37.21 7.56,36.26 U3.9
  Top Layer w0.635: D6.2 5,43.26 5.9,42.36 C49.1 5.9,39.25 C48.2
DN2_VBUS: length 11.6
  Top Layer w0.254: C50.2 10.54,38.27 10.54,37.47 10.29,37.21 8.25,37.21 8.06,37.02 U3.8
  Top Layer w0.635: C50.2 10.72,40.8 11.14,41.22 11.14,42.96 D7.2
FULLPWRMGMTZ_SMBA1: length 49.1
  Top Layer w0.252: SW1.1 73.27,20.57 67.43,26.42 67.43,31.95 67.57,32.09 U2.36
  Top Layer w0.254: v1(73.25,14.73) 73.25,13.48 SW1.1 ; v1(70.74,33.4) 69.43,32.09 U2.36
  Bottom Layer w0.254: v1(73.25,14.73) 73.25,15.47 77.22,19.43 77.22,26.92 v1(70.74,33.4)
FULLPWRZ: length 4.6
  Top Layer w0.254: SW1.16 82.3,14.86 R24.1
GANGED: length 4.1
  Top Layer w0.254: SW1.13 80.92,9.66 R26.2
GANGED_SMBA2_HS: length 54.6
  Top Layer w0.252: 69.95,31.59 69.94,31.58 ; 75.94,18.04 75.94,22.61 v1(72.13,26.42)
  Top Layer w0.254: 75.95,18.05 D1.2 76.07,18.59 76.07,20.07 ; 75.95,18.05 75.95,15.37 74.93,14.35 74.93,10.16 74.42,9.65 73.78,9.65 ; 75.95,18.05 74.68,16.78 74.68,10.55 73.78,9.65 ; v1(70.75,32.38) 69.95,31.59 U2.35 ; 73.78,9.65 SW1.4
  Bottom Layer w0.252: v1(72.13,26.42) 72.13,29.72 v1(70.1,31.75)
  Bottom Layer w0.254: v1(76.07,20.3) 76.07,27.05 v1(70.75,32.38)
GRSTZ_TCK: length 57.1
  Top Layer w0.252: 60.19,27.09 57.25,27.09 56.96,26.8 C7.2
  Top Layer w0.254: v1(30.37,53.25) 29.54,53.25 ; 29.54,53.25 29.54,55.82 ; 29.54,53.25 29.51,53.25 R20.1 ; 57.29,27.06 54.68,27.06 C7.2 ; 57.29,27.06 60.16,27.06 60.19,27.09 ; 57.29,27.06 v1(57.29,26.83) ; 57.29,27.06 57.29,27.09
  Bottom Layer w0.254: v1(30.37,53.25) 36.97,53.25 57.29,32.93 v1(57.29,26.83)
ILIM1: length 12.3
  Top Layer w0.252: 8.56,35.98 9.3,36.72 11.28,36.72 R34.2
  Top Layer w0.254: v1(13.84,35.3) R34.2 12.7,35.81 11.76,36.75 8.81,36.75 8.56,36.5 U3.7
OVERCUR1Z_TDI: length 84.7
  Top Layer w0.252: 33.55,53.22 32.65,52.32 32.65,51.31 30.85,49.51 9.7,49.51 5.28,45.09 4.27,45.09 4.01,44.84 4.01,43.31 4.52,42.81 4.52,40.52 3.62,39.62 2.61,39.62 1.72,38.74 1.72,38.23 2.62,37.34 3.89,37.34 4.79,36.44 5.41,36.44 ; R32.1 5.41,35.13 5.41,36.44 ; U3.10 6.13,36.44 5.41,36.44
  Top Layer w0.254: JP1.5 33.55,53.1 R22.1 ; 60.19,30.09 54.61,30.09 54.04,30.66 52.53,30.66 52.07,31.11 v1(45.47,31.11)
  Bottom Layer w0.254: 37,44.41 45.47,35.94 v1(45.47,31.11)
OVERCUR2Z: length 79.6
  Top Layer w0.252: v1(41.95,32.46) 41.95,29.92 42.46,29.42 52.62,29.42 53.45,28.59 ; v1(29.76,37.8) 38.14,37.8 v1(41.95,33.99)
  Top Layer w0.254: U3.6 v1(10.2,35.51) 10.71,35.51 R27.1 v1(10.98,36.07) ; 60.19,28.59 53.35,28.59 52.52,29.42 52.47,29.46 41.4,29.46 38.74,32.13 v1(35.31,32.13)
  Bottom Layer w0.252: v1(41.95,33.99) v1(41.95,32.46) ; v1(29.76,37.8) 28.37,36.41 11.1,36.41 v1(10.2,35.51)
PWRCTL_POL: length 6.4
  Top Layer w0.254: 82.84,12.23 83.74,13.13 R19.1 ; 82.84,12.23 82.8,12.19 SW1.15 80.94,12.23 82.84,12.23
PWRCTL_POL_TDO: length 84.6
  Top Layer w0.252: U2.21 65.64,26.24 v1(65.27,26.61) ; SW1.2 72.83,12.19 71.36,13.66 v1(71.36,20.52)
  Top Layer w0.254: U2.21 65.64,12.97 v1(66.36,12.26) ; R23.1 35.55,53.22 JP1.3 ; SW1.2 73.15,12.32 v1(70.99,12.32)
  Bottom Layer w0.252: JP1.3 37.34,54.03 37.85,54.03 v1(65.27,26.61) v1(71.36,20.52)
  Bottom Layer w0.254: 71.12,12.38 70.99,12.26 v1(66.36,12.26)
PWRCTRL1_BATEN1: length 198.1
  Top Layer w0.252: v1(63.62,18.03) 64.33,17.33 64.33,11.23 66.13,9.43 67.4,9.43 70.99,5.84 ; v1(58.74,22.66) 52.39,16.31 23.18,16.31 8.56,30.93 8.56,31.06 ; 60.19,30.59 61.46,30.59 61.84,30.2 61.84,26.92 v1(62.35,26.42)
  Top Layer w0.254: U3.4 8.56,31.06 10.03,29.59 v1(10.67,29.59) ; 60.19,30.59 54.76,30.59 54.23,31.11 52.72,31.11 52.09,31.75 43.94,31.75 v1(43.69,32) 42.54,33.15 34.42,33.15 28.19,26.92 26.42,26.92 ; v1(66.29,9.4) 67.29,9.4 70.84,5.84 SW1.7
  Bottom Layer w0.252: 62.55,26.22 62.3,26.22 v1(58.74,22.66) ; 62.55,26.22 63.62,25.15 v1(63.62,18.03) ; 62.55,26.22 v1(62.35,26.42)
  Bottom Layer w0.254: v1(26.42,27.05) 23.88,29.59 v1(10.67,29.59) ; v1(66.29,9.4) 66.04,9.65 66.03,9.65 65.66,10.02 65.66,10.03 59.06,16.64 51.94,16.64 v1(43.69,24.89) v1(43.69,32)
PWRCTRL2_BATEN2: length 199
  Top Layer w0.252: 60.19,29.59 61.08,29.59 61.34,29.33 61.34,26.16 59.69,24.52 59.69,23.39 ; 59.69,23.39 58.42,23.39 57.15,22.12 52.58,22.12 50.79,23.92 50.79,25.7 48.52,27.96 47.25,27.96 46.49,27.2 40.14,27.2 39.37,27.96 36.58,27.96 36.33,28.22 32.52,28.22 30.48,26.19 15.57,26.19 U3.5 ; 59.69,23.39 59.69,9.28 58.8,8.38 58.8,5.84 60.07,4.57 64.64,4.57 66.42,6.35 68.96,6.35 70.73,4.57 71.24,4.57
  Top Layer w0.254: v1(10.67,30.42) 9.96,30.42 9.06,31.33 U3.5 ; SW1.8 71.24,4.57 67.3,8.51 v1(66.29,8.51) ; v1(42.8,30.1) 42.9,30.2 53.85,30.2 54.43,29.62 60.16,29.62 60.19,29.59
  Bottom Layer w0.254: 42.8,25.14 42.8,24.26 50.93,16.13 58.67,16.13 65.66,9.14 65.66,9.13 66.03,8.76 66.04,8.76 v1(66.29,8.51) ; 42.8,25.14 29.6,25.14 24.31,30.42 v1(10.67,30.42) ; 42.8,25.14 v1(42.8,30.1)
SCL: length 4.3
  Top Layer w0.254: R18.1 81.35,7.93 SW1.12
SCL_SMBCLK: length 112.7
  Top Layer w0.252: v1(58.54,31.75) 58.71,31.59 ; U1.6 40.96,16.83 44.83,16.83 v1(49.65,21.65) ; 71.24,8.38 v1(66.42,13.21)
  Top Layer w0.254: v1(45.33,25.53) 39.82,20.02 U1.6 ; SW1.5 70.36,8.38 67.56,11.18 v1(66.29,11.18) ; 60.19,31.59 57.57,31.59 57.1,32.06 v1(55.75,32.06)
  Bottom Layer w0.252: v1(66.42,13.21) 58.03,21.59 58.03,21.65 ; 58.03,21.65 58.03,31.24 v1(58.54,31.75) ; 58.03,21.65 v1(49.65,21.65)
  Bottom Layer w0.254: v1(45.33,25.53) 51.86,32.06 v1(55.75,32.06) ; v1(66.29,11.18) 59.89,17.58 53.21,17.58 45.24,25.55
SDA: length 4.4
  Top Layer w0.254: SW1.11 80.92,7.1 84.07,7.1 R17.2
SDA_SMBDAT: length 124.9
  Top Layer w0.252: v1(61.59,31.24) 61.44,31.09 60.19,31.09 ; 72.51,7.11 v1(72,7.62)
  Top Layer w0.254: v1(48.2,27.24) v1(45.33,24.38) 42.36,21.41 U1.5 ; v1(66.29,10.29) 67.31,10.29 70.49,7.11 SW1.6 ; v1(55.12,31.37) 57.14,31.37 57.42,31.09 60.19,31.09
  Bottom Layer w0.252: U1.5 51.57,8.75 65.15,8.75 66.04,7.86 71.11,7.86 72,8.75 ; v1(72,7.62) 72,8.75 ; 72,8.75 72,20.83 v1(61.59,31.24)
  Bottom Layer w0.254: v1(48.2,27.24) 52.32,31.37 v1(55.12,31.37) ; v1(66.29,10.29) 66.04,10.54 66.03,10.54 65.66,10.91 65.66,10.92 59.46,17.12 52.6,17.12 45.34,24.38
SMBUSZ: length 26.5
  Top Layer w0.252: 71.24,10.92 66.14,16.03
  Top Layer w0.254: SW1.3 69.72,10.92 66.14,14.51 U2.22
SMBUSZ_PD: length 4.3
  Top Layer w0.254: R25.2 84.5,10.92 SW1.14
TEST_TRSTZ: length 76.7
  Top Layer w0.252: v1(56.56,32.74) 55.57,33.73 55.57,34.49 54.67,35.39 52.23,35.39 37.86,49.76 R11.1 ; v1(53.26,27.41) 53.44,27.59
  Top Layer w0.254: R11.1 R8.2 37.55,53.25 JP1.1 ; v1(40.64,28.07) 42.04,28.07 42.42,28.45 52.2,28.45 53.06,27.59 60.19,27.59
  Bottom Layer w0.252: v1(56.56,32.74) 56.56,30.71 v1(53.26,27.41)
  Bottom Layer w0.254: 36.58,43.69 40.64,39.62 v1(40.64,28.07)
USB_DM_DN1: length 27.4
  Top Layer w0.254: 62.07,52.39 62.07,53.76 61.59,54.23 59.56,54.23 58.89,53.55 58.89,50.71 59.28,50.33 59.28,40.73 64.64,35.37 U2.42
USB_DM_DN2: length 24.9
  Top Layer w0.254: U12.2 60.03,5.5 60.45,5.08 62.61,5.08 63.25,5.72 63.25,8.38 62.88,8.75 62.88,23.66 62.64,23.9 U2.15
USB_DM_UP: length 28.1
  Top Layer w0.254: 91.15,25.79 91.95,25 91.95,23.94 91.03,23.02 89.59,23.02 arc(89.46,23.08) 89.4,23.21 89.4,23.3 arc(89.21,23.5) 89.02,23.3 89.02,23.21 arc(88.97,23.08) 88.83,23.02 79.79,23.02 75.25,27.56 68.96,27.56
USB_DP_DN1: length 27.2
  Top Layer w0.254: 60.07,52.39 60.07,50.67 59.68,50.28 59.68,49.7 arc(59.74,49.57) 59.87,49.51 60.64,49.51 arc(60.83,49.32) 60.64,49.13 59.87,49.13 arc(59.74,49.07) 59.68,48.94 59.68,48.75 arc(59.74,48.61) 59.87,48.56 60.64,48.56 arc(60.83,48.37) 60.64,48.18 59.87,48.18 arc(59.74,48.12) 59.68,47.99 59.68,47.8 arc(59.74,47.66) 59.87,47.61 60.64,47.61 arc(60.83,47.42) 60.64,47.22 59.87,47.22 arc(59.74,47.17) 59.68,47.03 59.68,40.9 65.14,35.44 U2.41
USB_DP_DN2: length 25.1
  Top Layer w0.254: U12.3 62.03,8.31 62.47,8.75 62.47,9.27 arc(62.42,9.41) 62.28,9.46 61.66,9.46 arc(61.47,9.65) 61.66,9.84 62.28,9.84 arc(62.42,9.9) 62.47,10.03 62.47,10.22 arc(62.42,10.36) 62.28,10.41 61.66,10.41 arc(61.47,10.6) 61.66,10.79 62.28,10.79 arc(62.42,10.85) 62.47,10.99 62.47,11.18 arc(62.42,11.31) 62.28,11.37 61.66,11.37 arc(61.47,11.56) 61.66,11.75 62.28,11.75 arc(62.42,11.8) 62.47,11.94 62.47,12.13 arc(62.42,12.26) 62.28,12.32 61.66,12.32 arc(61.47,12.51) 61.66,12.7 62.28,12.7 arc(62.42,12.76) 62.47,12.89 62.47,23.5 62.14,23.83 U2.14
USB_DP_UP: length 28
  Top Layer w0.254: 69.02,27.06 75.18,27.06 79.62,22.61 91.19,22.61 92.36,23.78 92.36,25 93.15,25.79
$1N4636: length 2
  Top Layer w0.254: R27..1 78.48,18.38
$1N5515: length 2.3
  Top Layer w0.254: R3.1 U1.1
$1N5523: length 2.4
  Top Layer w0.254: U1.2 37.42,10.21 R4.2
$1N5529: length 3.5
  Top Layer w0.254: U1.3 42.15,8.02 R5.2
$1N5685: length 6.4
  Top Layer w0.254: 36.77,20.13 36.77,18.47 U1.7 37.28,19.87 R7.2 36.77,20.13 ; 36.77,20.13 R1.1
$1N8206: length 11.1
  Top Layer w0.252: U2.24 70.23,22.05 70.23,21.59
  Top Layer w0.254: 70.23,20.62 70.23,21.59 68.71,23.11 67.82,23.11 67.14,23.79 U2.24
$1N9198: length 19.7
  Top Layer w0.252: 68.27,37.38 68.27,36.11 66.64,34.48
  Top Layer w0.254: 69.72,38.84 R13.2 ; 69.72,38.84 69.79,38.91 C18.2 69.79,41.97 69.72,42.04 ; 69.72,38.84 69.72,37.85 69.19,37.31 R13.2 ; 69.72,38.84 69.72,42.04 ; R13.2 68.2,36.18 66.64,34.62 U2.38 ; 69.72,42.04 Y1.1
$1N9206: length 16.4
  Top Layer w0.252: 66.14,34.77 66.14,34.98 66.69,35.53
  Top Layer w0.254: U2.39 66.14,34.77 66.69,35.32 R13.1 ; C19.2 65.22,42.09 Y1.2 65.4,39.39 C19.2 ; C19.2 65.22,38.78 ; 65.22,38.78 65.22,37.77 65.68,37.31 R13.1 ; 65.22,38.78 R13.1
$1N11093: length 5.6
  Top Layer w0.254: 20.7,55.17 FB3.1 20.65,57.86 J7.1 20.7,55.17
$1N11978: length 3
  Top Layer w0.254: FB4.1 82.5,57.07 J8.1
$2N1264: length 24.7
  Top Layer w0.254: SW3.2 19.05,11.94 19.81,11.94 23.41,8.34 J5.3 24.55,5.33 C47.2 26.35,3.48 R33.2
$2N2113: length 4.4
  Top Layer w0.254: 4.67,46.09 D6.1 3.26,46.43 R35.2 4.67,46.09
$2N2181: length 4.1
  Top Layer w0.254: R36.2 9.9,46.36 D7.1 7.9,46.38 R36.2
$2N3339: length 3.9
  Top Layer w0.254: 15.36,46.35 D8.1 13.73,46.49 R39.2 15.36,46.35
$2N4070: length 1.9
  Top Layer w0.254: C55.1 27.08,38.42 R40.1

## Copper pours and planes (outline as drawn; the poured copper is in the pictures)
BOARD_5V on Top Layer: 13.43,32.8 14.12,31.7 17.11,31.7 17.11,28.42 17.02,28.32 14.28,28.32 12.45,25.65 12.45,24.26 12.06,23.88 9.02,23.88 9.02,25.78 7.87,26.92 6.1,26.92 5.9,27.12 5.9,31.43 6.79,31.43 7.37,32 7.37,33.2 8.28,33.2 8.28,31.75 7.62,31.09 7.62,28.7 9.14,27.18 11.43,27.18 12.19,27.94 12.19,32.8
